# Altium schematic sheet MCU.SchDoc
size A
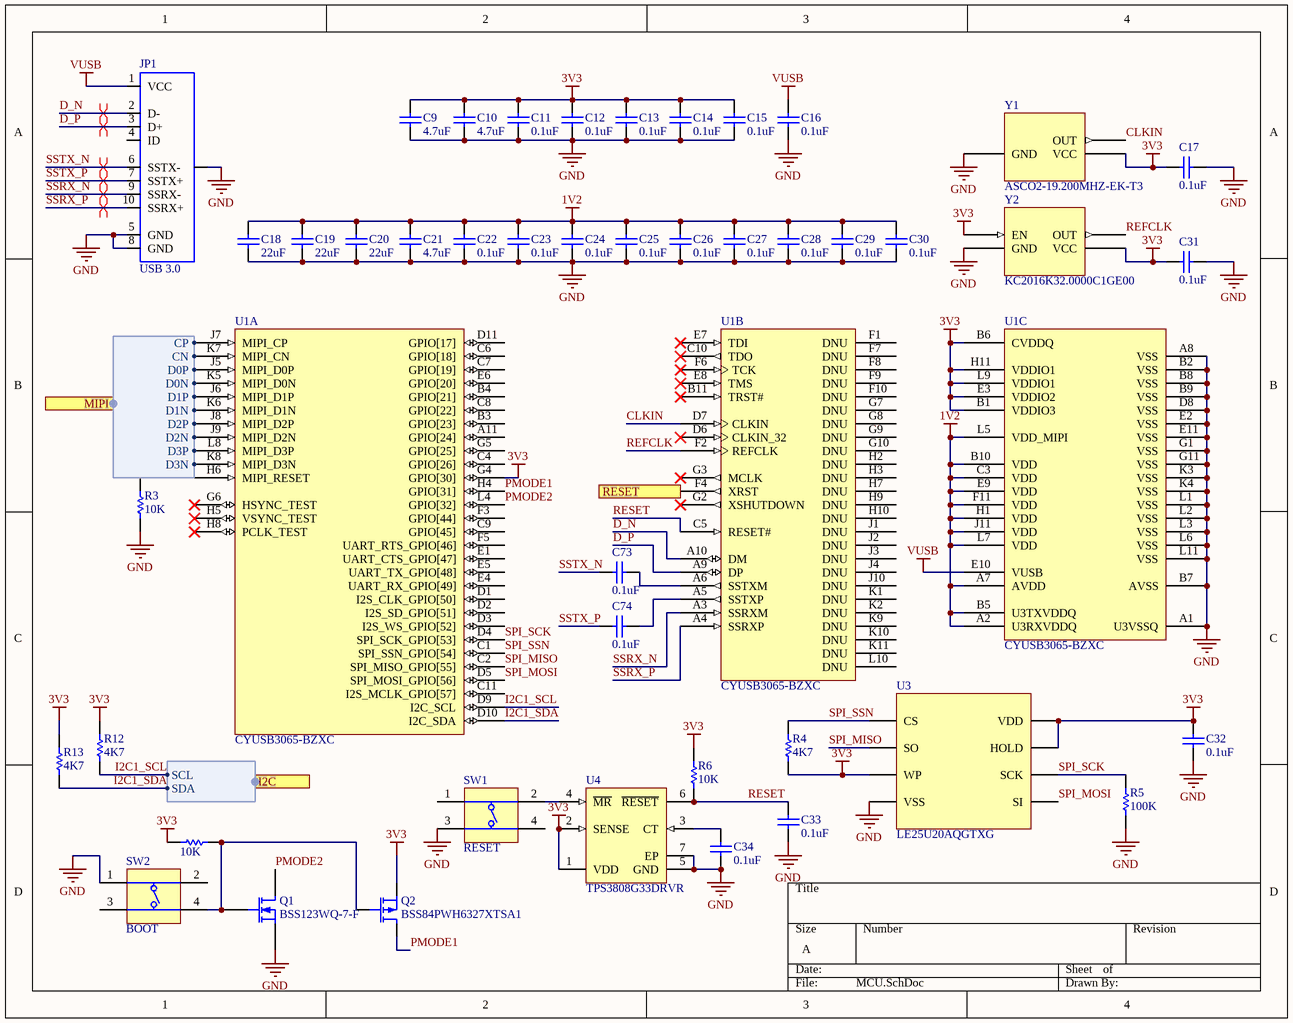
[diagram p0: MCU.SchDoc]

## Parts
?  value 10K  [R0402[1005]]  (hidden comment: 10K 1% 0402)
C9  value 4.7uF  [C0402[1005X55]]  (hidden comment: 4.7uF 6.3V 0402)
C10  value 4.7uF  [C0402[1005X55]]  (hidden comment: 4.7uF 6.3V 0402)
C11  value 0.1uF  [C0402[1005X55]]  (hidden comment: 0.1uF 6.3V 0402)
C12  value 0.1uF  [C0402[1005X55]]  (hidden comment: 0.1uF 6.3V 0402)
C13  value 0.1uF  [C0402[1005X55]]  (hidden comment: 0.1uF 6.3V 0402)
C14  value 0.1uF  [C0402[1005X55]]  (hidden comment: 0.1uF 6.3V 0402)
C15  value 0.1uF  [C0402[1005X55]]  (hidden comment: 0.1uF 6.3V 0402)
C16  value 0.1uF  [C0402[1005X55]]  (hidden comment: 0.1uF 6.3V 0402)
C17  value 0.1uF  [C0402[1005X55]]  (hidden comment: 0.1uF 6.3V 0402)
C18  value 22uF  [C0603[1608X92]]  (hidden comment: 22uF 6.3V 0603)
C19  value 22uF  [C0603[1608X92]]  (hidden comment: 22uF 6.3V 0603)
C20  value 22uF  [C0603[1608X92]]  (hidden comment: 22uF 6.3V 0603)
C21  value 4.7uF  [C0402[1005X55]]  (hidden comment: 4.7uF 6.3V 0402)
C22  value 0.1uF  [C0402[1005X55]]  (hidden comment: 0.1uF 6.3V 0402)
C23  value 0.1uF  [C0402[1005X55]]  (hidden comment: 0.1uF 6.3V 0402)
C24  value 0.1uF  [C0402[1005X55]]  (hidden comment: 0.1uF 6.3V 0402)
C25  value 0.1uF  [C0402[1005X55]]  (hidden comment: 0.1uF 6.3V 0402)
C26  value 0.1uF  [C0402[1005X55]]  (hidden comment: 0.1uF 6.3V 0402)
C27  value 0.1uF  [C0402[1005X55]]  (hidden comment: 0.1uF 6.3V 0402)
C28  value 0.1uF  [C0402[1005X55]]  (hidden comment: 0.1uF 6.3V 0402)
C29  value 0.1uF  [C0402[1005X55]]  (hidden comment: 0.1uF 6.3V 0402)
C30  value 0.1uF  [C0402[1005X55]]  (hidden comment: 0.1uF 6.3V 0402)
C31  value 0.1uF  [C0402[1005X55]]  (hidden comment: 0.1uF 6.3V 0402)
C32  value 0.1uF  [C0402[1005X55]]  (hidden comment: 0.1uF 6.3V 0402)
C33  value 0.1uF  [C0402[1005X55]]  (hidden comment: 0.1uF 6.3V 0402)
C34  value 0.1uF  [C0402[1005X55]]  (hidden comment: 0.1uF 100V 0402)
C73  value 0.1uF  [C0402[1005X55]]  (hidden comment: 0.1uF 6.3V 0402)
C74  value 0.1uF  [C0402[1005X55]]  (hidden comment: 0.1uF 6.3V 0402)
JP1  USB 3.0  [USB-MICROB-3.0]
Q1  BSS123WQ-7-F  [SOT323-3]
Q2  BSS84PWH6327XTSA1  [SOT323-3]
R3  value 10K  [R0402[1005]]  (hidden comment: 10K 1% 0402)
R4  value 4K7  [R0402[1005]]  (hidden comment: 4K7 1% 0402)
R5  value 100K  [R0402[1005]]  (hidden comment: 100K 1% 0402)
R6  value 10K  [R0402[1005]]  (hidden comment: 10K 1% 0402)
R12  value 4K7  [R0402[1005]]  (hidden comment: 4K7 1% 0402)
R13  value 4K7  [R0402[1005]]  (hidden comment: 4K7 1% 0402)
SW1  RESET  [SWITCH]
SW2  BOOT  [SWITCH]
U1  CYUSB3065-BZXC  [BGA-121]  (parts A,B,C of 3)
U3  LE25U20AQGTXG  [WDFN-8 (2x3MM)]
U4  TPS3808G33DRVR  [WSON-6]
Y1  ASCO2-19.200MHZ-EK-T3  [ASCO]
Y2  KC2016K32.0000C1GE00  [KC2016K]

## Ports
I2C (harness I2C), MIPI (harness MIPI), RESET (out)

## Harnesses
I2C: SCL, SDA
MIPI: CP, CN, D0P, D0N, D1P, D1N, D2P, D2N, D3P, D3N

## Nets
1V2: C18.2 C19.2 C20.2 C21.2 C22.2 C23.2 C24.2 C25.2 C26.2 C27.2 C28.2 C29.2 C30.2 U1.A2(U3RXVDDQ) U1.A7(AVDD) U1.B5(U3TXVDDQ) U1.B10(VDD) U1.C3(VDD) U1.E9(VDD) U1.F11(VDD) U1.H1(VDD) U1.J11(VDD) U1.L5(VDD_MIPI) U1.L7(VDD)
3V3: ?.2 C9.2 C10.2 C11.2 C12.2 C13.2 C14.2 C15.2 C17.2 C31.2 C32.2 Q2.2(S) R4.1 R6.2 R12.2 R13.2 U1.B1(VDDIO3) U1.B6(CVDDQ) U1.E3(VDDIO2) U1.G4(GPIO[30]) U1.H11(VDDIO1) U1.L9(VDDIO1) U3.3(WP) U3.7(HOLD) U3.8(VDD) U4.1(VDD) U4.2(SENSE) Y1.4(VCC) Y2.1(EN) Y2.4(VCC)
GND: C9.1 C10.1 C11.1 C12.1 C13.1 C14.1 C15.1 C16.1 C17.1 C18.1 C19.1 C20.1 C21.1 C22.1 C23.1 C24.1 C25.1 C26.1 C27.1 C28.1 C29.1 C30.1 C31.1 C32.1 C33.1 C34.1 JP1.5(GND) JP1.8(GND) JP1.11(SHIELD) Q1.2(S) R3.1 R5.1 SW1.3(T3) SW2.1(T1) U1.A1(U3VSSQ) U1.A8(VSS) U1.B2(VSS) U1.B7(AVSS) U1.B8(VSS) U1.B9(VSS) U1.D8(VSS) U1.E2(VSS) U1.E11(VSS) U1.G1(VSS) U1.G11(VSS) U1.K3(VSS) U1.K4(VSS) U1.L1(VSS) U1.L2(VSS) U1.L3(VSS) U1.L6(VSS) U1.L11(VSS) U3.4(VSS) U4.5(GND) U4.7(EP) Y1.2(GND) Y2.2(GND)
VUSB: C16.2 JP1.1(VCC) U1.E10(VUSB)
CLKIN: U1.D7(CLKIN) Y1.3(OUT)
D_N: JP1.2(D-) U1.A10(DM)
D_P: JP1.3(D+) U1.A9(DP)
I2C1_SCL: R12.1 U1.D9(I2C_SCL) ; port I2C.SCL
I2C1_SDA: R13.1 U1.D10(I2C_SDA) ; port I2C.SDA
PMODE1: Q2.3(D) U1.H4(GPIO[31])
PMODE2: Q1.3(D) U1.L4(GPIO[32])
REFCLK: U1.F2(REFCLK) Y2.3(OUT)
RESET: C33.2 R6.1 U1.C5(RESET#) U4.6(~{RESET})
RESET: U1.F4(XRST) ; port RESET  [a separate net that carries the same name]
SPI_MISO: U1.C2(SPI_MISO_GPIO[55]) U3.2(SO)
SPI_MOSI: U1.D5(SPI_MOSI_GPIO[56]) U3.5(SI)
SPI_SCK: R5.2 U1.D4(SPI_SCK_GPIO[53]) U3.6(SCK)
SPI_SSN: R4.2 U1.C1(SPI_SSN_GPIO[54]) U3.1(CS)
SSRX_N: JP1.9(SSRX-) U1.A3(SSRXM)
SSRX_P: JP1.10(SSRX+) U1.A4(SSRXP)
SSTX_N: C73.1 JP1.6(SSTX-)
SSTX_P: C74.1 JP1.7(SSTX+)
Net?_1: ?.1 Q1.1(G) Q2.1(G) SW2.4(T3)
NetC34_2: C34.2 U4.3(CT)
NetC73_2: C73.2 U1.A6(SSTXM)
NetC74_2: C74.2 U1.A5(SSTXP)
NetR3_2: R3.2 U1.H6(MIPI_RESET)
NetSW1_2: SW1.2(T2) U4.4(~{MR})
NetU1_J5: U1.J5(MIPI_D0P) ; port MIPI.D0P
NetU1_J6: U1.J6(MIPI_D1P) ; port MIPI.D1P
NetU1_J7: U1.J7(MIPI_CP) ; port MIPI.CP
NetU1_J8: U1.J8(MIPI_D2P) ; port MIPI.D2P
NetU1_J9: U1.J9(MIPI_D2N) ; port MIPI.D2N
NetU1_K5: U1.K5(MIPI_D0N) ; port MIPI.D0N
NetU1_K6: U1.K6(MIPI_D1N) ; port MIPI.D1N
NetU1_K7: U1.K7(MIPI_CN) ; port MIPI.CN
NetU1_K8: U1.K8(MIPI_D3N) ; port MIPI.D3N
NetU1_L8: U1.L8(MIPI_D3P) ; port MIPI.D3P

Not connected (* = marked no-connect by the designer): JP1 4(ID); SW1 1(T1) 4(T3); SW2 2(T2) 3(T3); U1 A11(GPIO[24]) B3(GPIO[23]) B4(GPIO[21]) B11(TRST#)* C4(GPIO[26]) C6(GPIO[18]) C7(GPIO[19]) C8(GPIO[22]) C9(GPIO[45]) C10(TDO)* C11(I2S_MCLK_GPIO[57]) D1(I2S_CLK_GPIO[50]) D2(I2S_SD_GPIO[51]) D3(I2S_WS_GPIO[52]) D6(CLKIN_32)* D11(GPIO[17]) E1(UART_CTS_GPIO[47]) E4(UART_RX_GPIO[49]) E5(UART_TX_GPIO[48]) E6(GPIO[20]) E7(TDI)* E8(TMS)* F1(DNU) F3(GPIO[44]) F5(UART_RTS_GPIO[46]) F6(TCK)* F7(DNU) F8(DNU) F9(DNU) F10(DNU) G2(XSHUTDOWN)* G3(MCLK)* G5(GPIO[25]) G6(HSYNC_TEST)* G7(DNU) G8(DNU) G9(DNU) G10(DNU) H2(DNU) H3(DNU) H5(VSYNC_TEST)* H7(DNU) H8(PCLK_TEST)* H9(DNU) H10(DNU) J1(DNU) J2(DNU) J3(DNU) J4(DNU) J10(DNU) K1(DNU) K2(DNU) K9(DNU) K10(DNU) K11(DNU) L10(DNU)

## Layout directives
differential pair; differential pair class USB2: D_N, D_P
differential pair; differential pair class SSTX: SSTX_N, SSTX_P
differential pair; differential pair class SSRX: SSRX_N, SSRX_P

## Library data of the parts
? R3 R6 = RES_10K_0402_1%: 10K 0.063W 1% 0402 (1005 Metric); Manufacturer: KOA Speer; PartNumber: RK73H1ETTP1002F; Tolerance: 1%; Power: 0.063W; Mounting Technology: Surface Mount; PackageReference: 0402; PackageDescription: 0402 (1005 Metric); ComponentLink1Description: Datasheet; ComponentLink1URL: http://www.koaspeer.com/catimages/Products/RK73H/RK73H.pdf
C9 C10 C21 = CAP_4.7uF_6.3V_0402_20%: 4.7uF 6.3V 20% 0402 (1005 Metric); PartNumber: GRM155R60J475ME47D; Manufacturer: Murata; Mounting Technology: Surface Mount; PackageReference: 0402; PackageDescription: 0402 (1005 Metric); Voltage: 6.3V; Tolerance: 20%
C11-C17 C22-C33 C73 C74 = CAP_0.1uF_6.3V_0402_10%: 0.1uF 6.3V 10% 0402 (1005 Metric); PartNumber: GRM155R70J104KA01D; Manufacturer: Murata; Mounting Technology: Surface Mount; PackageReference: 0402; PackageDescription: 0402 (1005 Metric); Voltage: 6.3V; Tolerance: 10%
C18-C20 = CAP_22uF_6.3V_0603_10%: 22uF 6.3V 10% 0603 (1608 Metric); PartNumber: GRT188R60J226ME13D; Manufacturer: Murata; Mounting Technology: Surface Mount; PackageReference: 0603; PackageDescription: 0603 (1608 Metric); Voltage: 6.3V; Tolerance: 10%
C34 = CAP_0.1uF_100V_0402_10%: 0.1uF 100V 10% 0402 (1005 Metric); PartNumber: GRM155R62A104KE14D; Manufacturer: Murata; Mounting Technology: Surface Mount; PackageReference: 0402; PackageDescription: 0402 (1005 Metric); Voltage: 100V; Tolerance: 10%
JP1 = USB_MICROB_3.0_SMT: PartNumber: GSB343133HR; Manufacturer: Amphenol FCI; Mounting Technology: Surface Mount; PackageReference: USB 3.0 - Micro B
Q1 = BSS123WQ-7-F: N-Channel MOSFET; Manufacturer: Diodes Incorporated; PartNumber: BSS123WQ-7-F; PackageReference: SOT-323-3; Mounting Technology: Surface Mount
Q2 = BSS84PW H6327: P-Channel MOSFET; Manufacturer: Infineon; Mounting Technology: Surface Mount; PartNumber: BSS84PWH6327XTSA1; PackageReference: SOT323-3
R4 R12 R13 = RES_4K7_0402_1%: 4K7 0.063W 1% 0402 (1005 Metric); Manufacturer: KOA Speer; PartNumber: RK73H1ETTP4701F; Tolerance: 1%; Power: 0.063W; Mounting Technology: Surface Mount; PackageReference: 0402; PackageDescription: 0402 (1005 Metric); ComponentLink1Description: Datasheet; ComponentLink1URL: http://www.koaspeer.com/catimages/Products/RK73H/RK73H.pdf
R5 = RES_100K_0402_1%: 100K 0.063W 1% 0402 (1005 Metric); Manufacturer: KOA Speer; PartNumber: RK73H1ETTP1003F; Tolerance: 1%; Power: 0.063W; Mounting Technology: Surface Mount; PackageReference: 0402; PackageDescription: 0402 (1005 Metric); ComponentLink1Description: Datasheet; ComponentLink1URL: http://www.koaspeer.com/catimages/Products/RK73H/RK73H.pdf
SW1 SW2 = DIPT-DTSM-6: Switch, SPNO Push Button SMD; Manufacturer: C&K Components; PartNumber: PTS810 SJM 250 SMTR LFS; Packing Type: Tape&Reel; Mechanical Life: 200,000 cycles; ComponentLink2URL: http://www.dip.com.tw/Products_tact.htm; ComponentLink1URL: http://www.dip.com.tw/; ComponentLink3URL: http://www.dip.com.tw/PDF/pro_tact/DTSM_G_-6_2_-V.pdf; PackageDescription: Switch, Surface Mount, 4 Leads, Body 4.6x2.8mm, Height 1.9mm; ComponentLink2Description: Datasheet; ComponentLink3Description: Package Specification; ComponentLink1Description: Manufacturer URL; PackageReference: PTS810; Mounting Technology: Surface Mount
U1 = CYUSB3065-BZXCXC: MCU MIPI CSI-2 to USB Bridge Controller; Manufacturer: Cypress Semiconductor; Mounting Technology: Surface Mount; PartNumber: CYUSB3065-BZXC; PackageReference: BGA-121
U3 = LE25U20AQGTXG: IC FLASH 2M SPI 30MHZ 8WDFN; Manufacturer: ON Semiconductor; PartNumber: LE25U20AQGTXG; Mounting Technology: Surface Mount; PackageReference: WDFN-8
U4 = TPS3808G33DRVR: IC VOLT SUPERVISOR 3.3V; Manufacturer: Texas Instruments; PackageReference: WSON-6; Mounting Technology: Surface Mount; PartNumber: TPS3808G33DRVR
Y1 = ASCO2-19.200MHZ-EK-T3: OSC XO 19.2MHZ CMOS SMD; Manufacturer: Abracon; PartNumber: ASCO2-19.200MHZ-EK-T3; Mounting Technology: Surface Mount; PackageReference: SMD-4
Y2 = KC2016K32.0000C1GE00: OSC XO 32.0000MHZ CMOS SMD; Manufacturer: Kyocera; PartNumber: KC2016K32.0000C1GE00; Mounting Technology: Surface Mount; PackageReference: SMD-4